# Altium schematic sheet Block Diagram.SchDoc: Block Diagram
size B; SheetNumber: 1; SheetTotal: 7
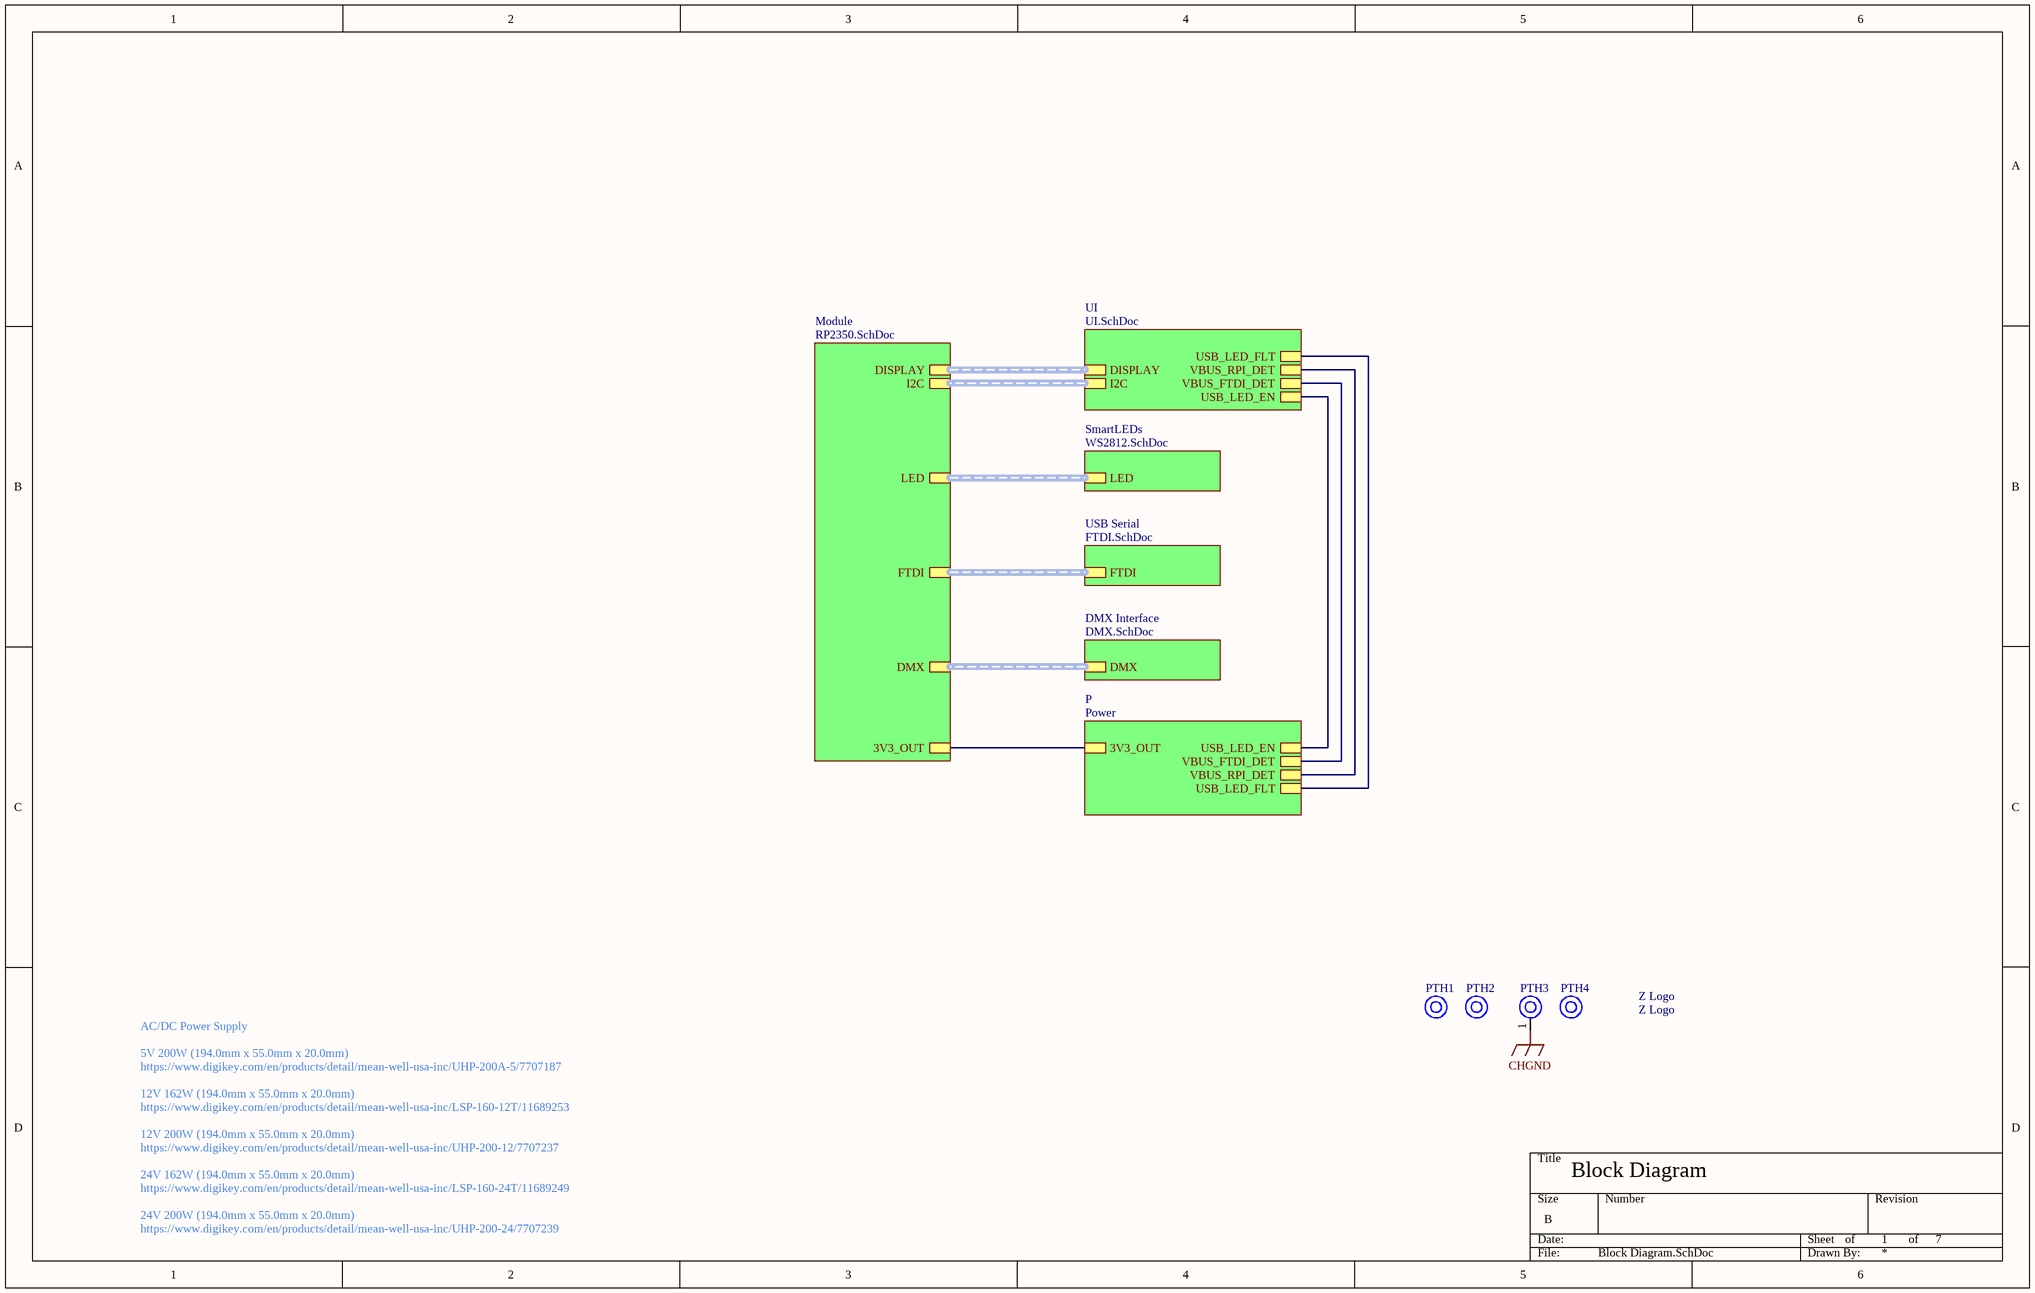
[diagram p0: Block Diagram.SchDoc]

## Parts
_1  Z Logo  [Z Logo 0.5"]  (no BOM)
PTH1  Mounting Hole NPTH  [Mounting Hole M3 No Washer NPTH]  (value not drawn)  (no BOM)
PTH2  Mounting Hole NPTH  [Mounting Hole M3 No Washer NPTH]  (value not drawn)  (no BOM)
PTH3  Mounting Hole  [Mounting Hole M3 No Washer]  (value not drawn)  (no BOM)
PTH4  Mounting Hole NPTH  [Mounting Hole M3 No Washer NPTH]  (value not drawn)  (no BOM)

## Sub-sheets
DMX Interface = DMX.SchDoc: DMX (harness DMX)
Module = RP2350.SchDoc: DMX (harness DMX), FTDI (harness FTDI), I2C (harness I2C), LED (harness LED), DISPLAY (harness DISPLAY), 3V3_OUT
P = Power: 3V3_OUT, USB_LED_EN, VBUS_FTDI_DET, VBUS_RPI_DET, USB_LED_FLT
SmartLEDs = WS2812.SchDoc: LED (harness LED)
UI = UI.SchDoc: DISPLAY (harness DISPLAY), I2C (harness I2C), USB_LED_EN, VBUS_FTDI_DET, VBUS_RPI_DET, USB_LED_FLT
USB Serial = FTDI.SchDoc: FTDI (harness FTDI)

## Nets
CHGND: PTH3.1
(unnamed): sheet Module/3V3_OUT, sheet P/3V3_OUT
(unnamed): sheet P/USB_LED_EN, sheet UI/USB_LED_EN
(unnamed): sheet P/VBUS_FTDI_DET, sheet UI/VBUS_FTDI_DET
(unnamed): sheet P/VBUS_RPI_DET, sheet UI/VBUS_RPI_DET
(unnamed): sheet P/USB_LED_FLT, sheet UI/USB_LED_FLT

## Buses and harness runs
harness sheet DMX Interface/DMX = sheet Module/DMX
harness sheet Module/DISPLAY = sheet UI/DISPLAY
harness sheet Module/FTDI = sheet USB Serial/FTDI
harness sheet Module/I2C = sheet UI/I2C
harness sheet Module/LED = sheet SmartLEDs/LED

## Notes on the sheet
- AC/DC Power Supply
  5V 200W (194.0mm x 55.0mm x 20.0mm)
  https://www.digikey.com/en/products/detail/mean-well-usa-inc/UHP-200A-5/7707187
  12V 162W (194.0mm x 55.0mm x 20.0mm)
  https://www.digikey.com/en/products/detail/mean-well-usa-inc/LSP-160-12T/11689253
  12V 200W (194.0mm x 55.0mm x 20.0mm)
  https://www.digikey.com/en/products/detail/mean-well-usa-inc/UHP-200-12/7707237
  24V 162W (194.0mm x 55.0mm x 20.0mm)
  https://www.digikey.com/en/products/detail/mean-well-usa-inc/LSP-160-24T/11689249
  24V 200W (194.0mm x 55.0mm x 20.0mm)
  https://www.digikey.com/en/products/detail/mean-well-usa-inc/UHP-200-24/7707239
- of

## Library data of the parts
_1 = CMP-00028-00046-1: Z logo silkscreen
PTH1 PTH2 PTH4 = CMP-00028-00043-4
PTH3 = CMP-00028-00008-6